# EAGLE design ADC121C021-VSSOP (EAGLE 8.1.1)
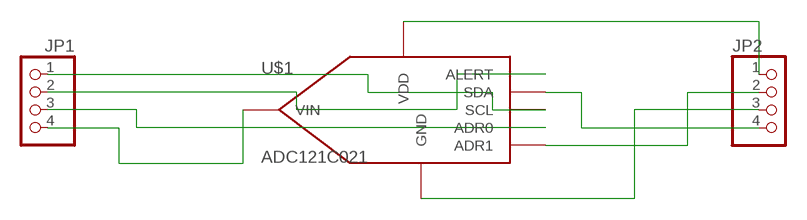
[diagram p0: schematic, sheet 1]

## Parts
JP1  PINHD-1X4  [1X04]
JP2  PINHD-1X4  [1X04]
U$1  ADC121C021  [VSSOP-8]

## Nets
N$1: JP1.1 U$1.P$1(SCL)
N$2: JP1.2 U$1.P$2(ALERT)
N$3: JP1.3 U$1.P$3(ADR0)
N$4: JP1.4 U$1.P$4(VIN)
N$5: JP2.1 U$1.P$5(VDD)
N$6: JP2.2 U$1.P$6(ADR1)
N$7: JP2.3 U$1.P$7(GND)
N$8: JP2.4 U$1.P$8(SDA)

## Library data of the parts
JP1 JP2 = pinhead:PINHD-1X4: PIN HEADER
U$1 = texas:ADC121C021: ADC121C021 8-pin VSSOP package 1 channel, 12-bit I2C ADC Datasheet <http://www.ti.com/lit/ds/symlink/adc121c021.pdf>

## Board
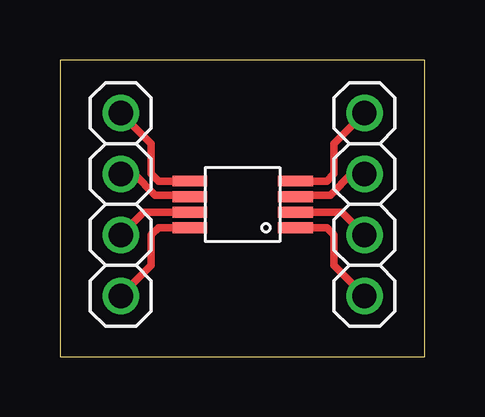
[diagram p1: board, top side]

Size 15.22 x 12.37 mm. Coordinates in mm from the lower left corner, seen from the top.
Outline: 0,0 15.22,0 15.22,12.37 0,12.37 0,0
Copper layers (1*16): Top 0.035mm / dielectric 1.5mm / Bottom 0.035mm
Design rules "default": minimum track width 10mil, minimum drill 24mil, track to track 8mil, track to pad 8mil, pad to pad 8mil, via to via 8mil, smd to smd 8mil, copper to edge 40mil, drill to drill 8mil, minimum pad ring 10mil, minimum via ring 8mil, stop-mask expansion 4mil, vias tented up to drill 0mil, thermal gap 10mil

### Footprints (pad centres in the part's own frame; a part is rotated, then mirrored left to right if it is on the bottom)
1X04 = drill 1.016: 1 -3.81,0; 2 -1.27,0; 3 1.27,0; 4 3.81,0
VSSOP-8 = smd 0.45 x 1.45: P$1 -0.975,-2.2; P$2 -0.325,-2.2; P$3 0.325,-2.2; P$4 0.975,-2.2; P$5 0.975,2.2; P$6 0.325,2.2; P$7 -0.325,2.2; P$8 -0.975,2.2

### Placement (x,y rotation side)
JP1  12.7,6.35 90 top
JP2  2.54,6.35 270 top
U$1  7.62,6.35 90 top

### Tracks (layer width: path | path; a pad name or v marks a point on that pad's centre or on a via)
N$1
  Top 0.305: U$1.P$1 11.13,5.38 11.43,5.08 11.43,3.81 JP1.1
N$2
  Top 0.305: U$1.P$2 11.76,6.03 JP1.2
N$3
  Top 0.305: U$1.P$3 9.89,6.74 11.27,6.74 12.15,7.62 JP1.3
N$4
  Top 0.305: U$1.P$4 11.13,7.33 11.43,7.62 11.43,8.89 JP1.4
N$5
  Top 0.305: U$1.P$5 4.11,7.33 3.81,7.62 3.81,8.89 JP2.1
N$6
  Top 0.305: U$1.P$6 5.35,6.74 3.97,6.74 3.09,7.62 JP2.2
N$7
  Top 0.305: U$1.P$7 3.48,6.03 JP2.3
N$8
  Top 0.305: U$1.P$8 4.11,5.38 3.81,5.08 3.81,3.81 JP2.4